# EAGLE schematic 3Sens+lowPass (EAGLE 6.4)
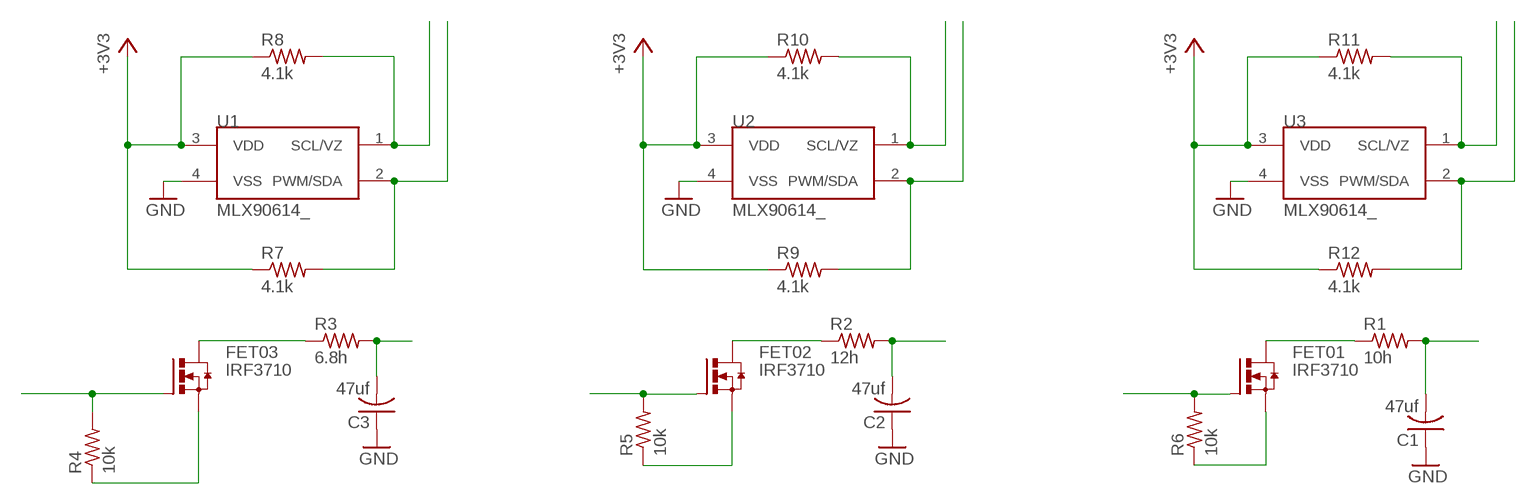
[diagram p0: schematic, sheet 1]

## Parts
C1  47uf  C-US025-024X044  [C025-024X044]
C2  47uf  C-US025-024X044  [C025-024X044]
C3  47uf  C-US025-024X044  [C025-024X044]
FET01  IRF3710  IRF3704  [TO220AH]
FET02  IRF3710  IRF3704  [TO220AH]
FET03  IRF3710  IRF3704  [TO220AH]
R1  10h  R-US_0204/2V  [0204V]
R2  12h  R-US_0204/2V  [0204V]
R3  6.8h  R-US_0204/2V  [0204V]
R4  10k  R-US_0204/2V  [0204V]
R5  10k  R-US_0204/2V  [0204V]
R6  10k  R-US_0204/2V  [0204V]
R7  4.1k  R-US_0204/2V  [0204V]
R8  4.1k  R-US_0204/2V  [0204V]
R9  4.1k  R-US_0204/2V  [0204V]
R10  4.1k  R-US_0204/2V  [0204V]
R11  4.1k  R-US_0204/2V  [0204V]
R12  4.1k  R-US_0204/2V  [0204V]
U1  MLX90614_  [TO-39]
U2  MLX90614_  [TO-39]
U3  MLX90614_  [TO-39]

## Nets
+3V3: R7.1 R8.1 R9.1 R10.1 R11.1 R12.1 U1.3(VDD) U2.3(VDD) U3.3(VDD)
GND: C1.1 C2.1 C3.1 U1.4(VSS) U2.4(VSS) U3.4(VSS)
N$1: R8.2 U1.1(SCL/VZ)
N$2: FET03.E(S) R4.1
N$3: FET02.B(G) R5.2
N$4: FET02.E(S) R5.1
N$5: FET01.B(G) R6.2
N$6: FET01.E(S) R6.1
N$7: C3.2 R3.2
N$8: R7.2 U1.2(PWM/SDA)
N$9: FET03.B(G) R4.2
N$10: C2.2 R2.2
N$11: C1.2 R1.2
N$12: R10.2 U2.1(SCL/VZ)
N$13: R9.2 U2.2(PWM/SDA)
N$14: FET03.C(D) R3.1
N$15: R11.2 U3.1(SCL/VZ)
N$16: R12.2 U3.2(PWM/SDA)
N$17: FET02.C(D) R2.1
N$18: FET01.C(D) R1.1

## Library data of the parts
C1-C3 = rcl:C-US: CAPACITOR, American symbol
FET01-FET03 = transistor-power:IRF3704: SMPS MOSFET HEXFET® Power MOSFET Source: http://www.irf.com/product-info/datasheets/data/irf3704.pdf
R1-R12 = resistor:R-US_: RESISTOR, American symbol
U1-U3 = SparkFun-Sensors:MLX90614: Non-contact PIR I2C interface temperature sensor